# EAGLE schematic 08D-005 (EAGLE 6.3)
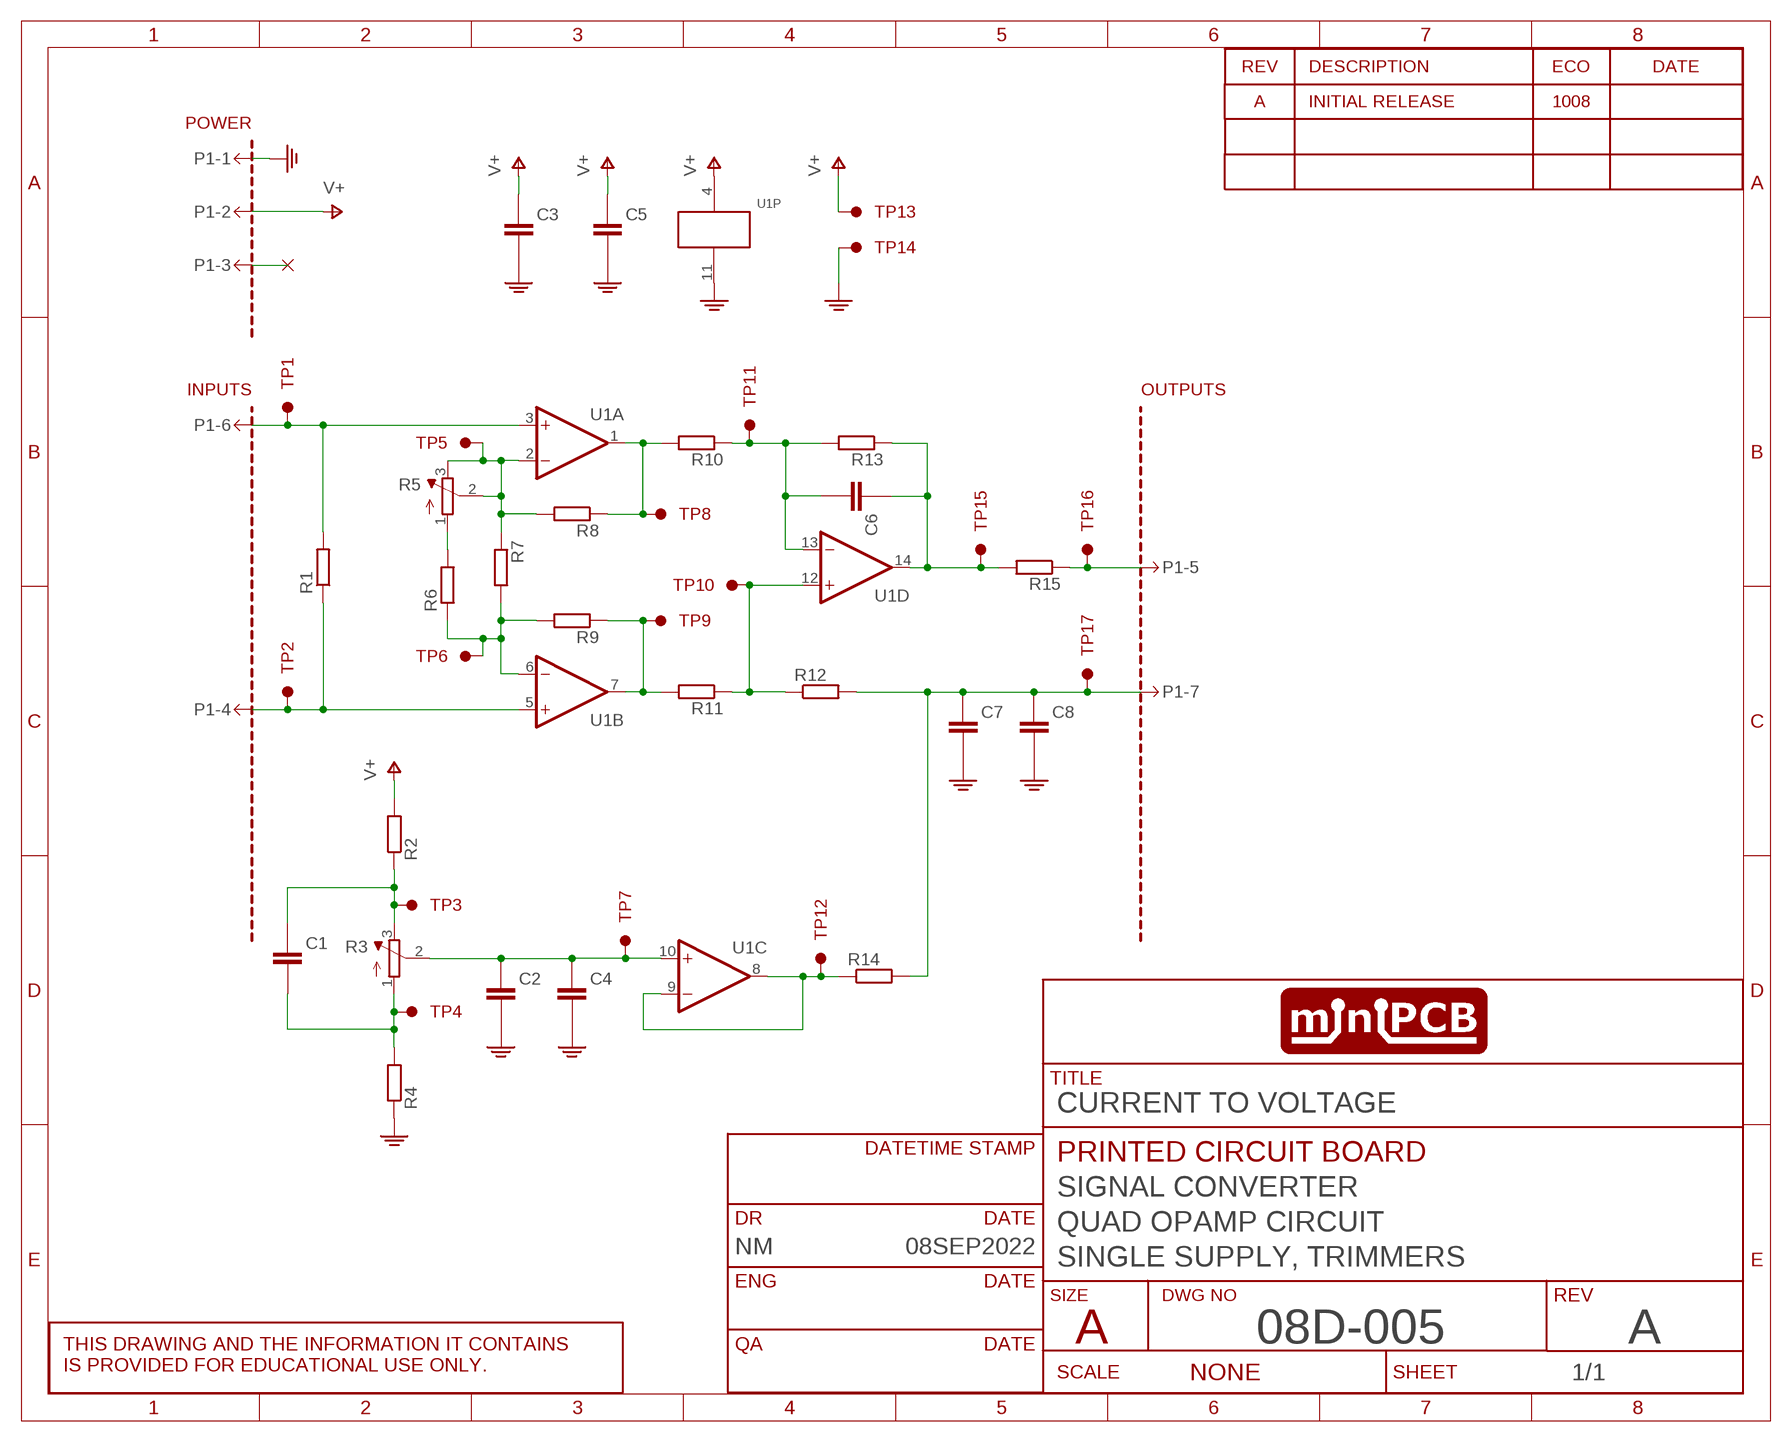
[diagram p0: schematic, sheet 1]
SHEET1 (SCHEMATIC): CIRCUIT_CATEGORY: SIGNAL CONVERTER; CIRCUIT_NAME: QUAD OPAMP CIRCUIT; CIRCUIT_VARIANT: SINGLE SUPPLY, TRIMMERS; DR: NM; DR_DATE: 08SEP2022; REVA: A; REVA_ECO: 1008; REVISION: A; TITLE: CURRENT TO VOLTAGE

## Parts
C1  CAPACITORTHD  [C050-024X044]
C2  CAPACITORTHD  [C050-024X044]
C3  CAPACITORTHD  [C050-024X044]
C4  CAPACITORTHD  [C050-024X044]
C5  CAPACITORTHD  [C050-024X044]
C6  CAPACITORTHD  [C050-024X044]
C7  CAPACITORTHD  [C050-024X044]
C8  CAPACITORTHD  [C050-024X044]
P1-  MINIPCB_7P50X100  [MINIPCB_7P_50X100]
R1  RESISTOR10MM  [0207/10]
R2  RESISTOR10MM  [0207/10]
R3  TRIMPOT0.100THD  [TRIM_0100]
R4  RESISTOR10MM  [0207/10]
R5  TRIMPOT0.100THD  [TRIM_0100]
R6  RESISTOR10MM  [0207/10]
R7  RESISTOR10MM  [0207/10]
R8  RESISTOR10MM  [0207/10]
R9  RESISTOR10MM  [0207/10]
R10  RESISTOR10MM  [0207/10]
R11  RESISTOR10MM  [0207/10]
R12  RESISTOR10MM  [0207/10]
R13  RESISTOR10MM  [0207/10]
R14  RESISTOR10MM  [0207/10]
R15  RESISTOR10MM  [0207/10]
TP1  TESTPOINTKE5000-SMTEXT  [PINS_1_TESTPOINT_KE5000_NOTEXT]
TP2  TESTPOINTKE5000-SMTEXT  [PINS_1_TESTPOINT_KE5000_NOTEXT]
TP3  TESTPOINTKE5000-SMTEXT  [PINS_1_TESTPOINT_KE5000_NOTEXT]
TP4  TESTPOINTKE5000-SMTEXT  [PINS_1_TESTPOINT_KE5000_NOTEXT]
TP5  TESTPOINTKE5000-SMTEXT  [PINS_1_TESTPOINT_KE5000_NOTEXT]
TP6  TESTPOINTKE5000-SMTEXT  [PINS_1_TESTPOINT_KE5000_NOTEXT]
TP7  TESTPOINTKE5000-SMTEXT  [PINS_1_TESTPOINT_KE5000_NOTEXT]
TP8  TESTPOINTKE5000-SMTEXT  [PINS_1_TESTPOINT_KE5000_NOTEXT]
TP9  TESTPOINTKE5000-SMTEXT  [PINS_1_TESTPOINT_KE5000_NOTEXT]
TP10  TESTPOINTKE5000-SMTEXT  [PINS_1_TESTPOINT_KE5000_NOTEXT]
TP11  TESTPOINTKE5000-SMTEXT  [PINS_1_TESTPOINT_KE5000_NOTEXT]
TP12  TESTPOINTKE5000-SMTEXT  [PINS_1_TESTPOINT_KE5000_NOTEXT]
TP13  TESTPOINTKE5000-SMTEXT  [PINS_1_TESTPOINT_KE5000_NOTEXT]
TP14  TESTPOINTKE5000-SMTEXT  [PINS_1_TESTPOINT_KE5000_NOTEXT]
TP15  TESTPOINTKE5000-SMTEXT  [PINS_1_TESTPOINT_KE5000_NOTEXT]
TP16  TESTPOINTKE5000-SMTEXT  [PINS_1_TESTPOINT_KE5000_NOTEXT]
TP17  TESTPOINTKE5000-SMTEXT  [PINS_1_TESTPOINT_KE5000_NOTEXT]
U1  OPAMP_QUADTHD  [DIL14]

## Nets
BIAS: C2.1(+) C4.1(+) R3.2(S) TP7.1 U1.10(C:+IN)
GND: C2.2(-) C3.2(-) C4.2(-) C5.2(-) C7.2(-) C8.2(-) P1-.1 R4.1 TP14.1 U1.11(P:V-)
N$1: R11.1 R12.1 TP10.1 U1.12(D:+IN)
N$2: C7.1(+) C8.1(+) P1-.7 R12.2 R14.2 TP17.1
N$3: P1-.4 R1.1 TP2.1 U1.5(B:+IN)
N$4: P1-.6 R1.2 TP1.1 U1.3(A:+IN)
N$5: R5.2(S) R5.3(E) R7.1 R8.2 TP5.1 U1.2(A:-IN)
N$6: R6.1 R7.2 R9.2 TP6.1 U1.6(B:-IN)
N$7: R8.1 R10.2 TP8.1 U1.1(A:OUT)
N$8: R9.1 R11.2 TP9.1 U1.7(B:OUT)
N$9: R14.1 TP12.1 U1.8(C:OUT) U1.9(C:-IN)
N$10: R5.1(A) R6.2
N$11: P1-.5 R15.1 TP16.1
NC: P1-.3
OUT: C6.1(+) R13.1 R15.2 TP15.1 U1.14(D:OUT)
POT.1: C1.2(-) R3.1(A) R4.2 TP4.1
POT.3: C1.1(+) R2.1 R3.3(E) TP3.1
V+: C3.1(+) C5.1(+) P1-.2 R2.2 TP13.1 U1.4(P:V+)
VFB: C6.2(-) R10.1 R13.2 TP11.1 U1.13(D:-IN)

## Library data of the parts
C1-C8 = minipcb:CAPACITOR
P1- = minipcb:MINIPCB_7P; PART_NUMBER: X08D-005-A
R1 R2 R4 R6-R15 = minipcb:RESISTOR
R3 R5 = minipcb:TRIMPOT: SMT trimmer potentiometer part number TC33X http://www.ladyada.net/library/eagle
TP1-TP17 = minipcb:TESTPOINT
U1 = minipcb:OPAMP_QUAD: OP AMP